# Altium schematic sheet main.SchDoc
size A; SheetNumber: 1; SheetTotal: 2
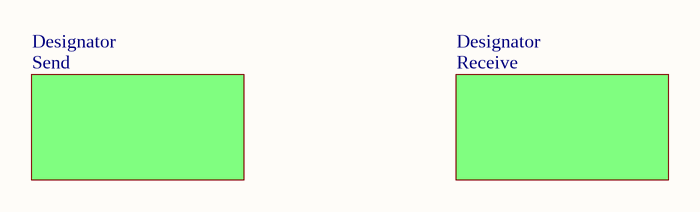
[diagram p0: main.SchDoc]

## Sub-sheets
Designator = Send: no entries
Designator = Receive: no entries